# Altium schematic sheet Microcontroller.SchDoc
size A4; SheetNumber: 2; SheetTotal: 5
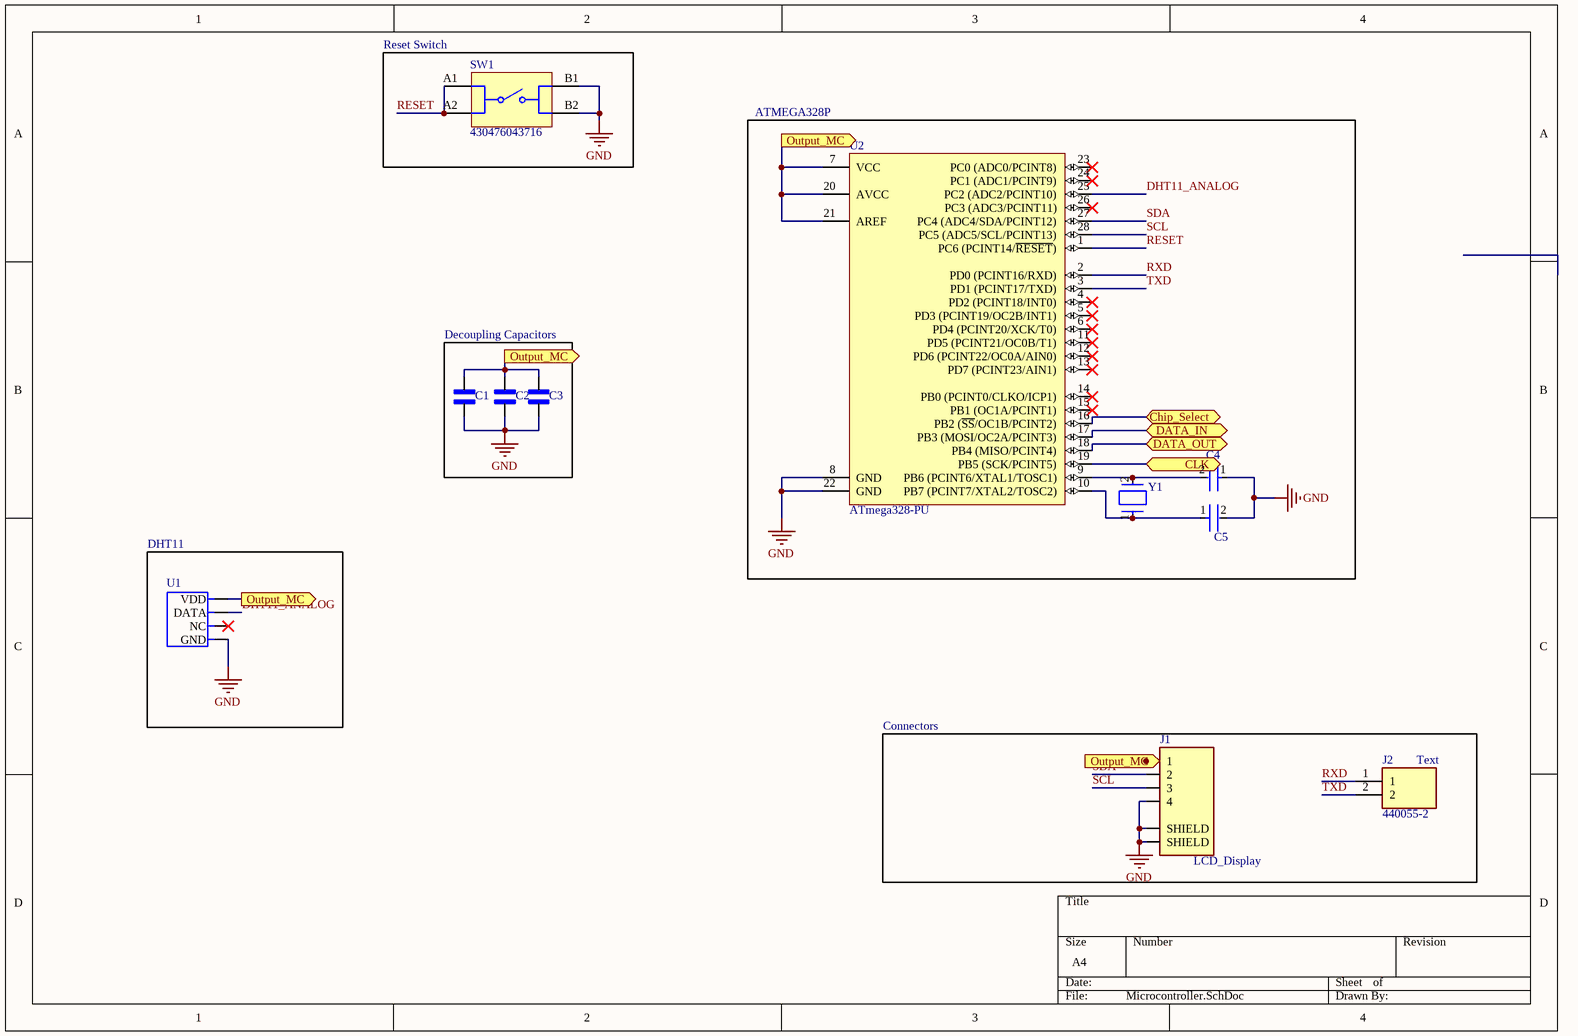
[diagram p0: Microcontroller.SchDoc]

## Parts
C1  GRM033C71C104ME14D  [CAPC0603X33N]  (value not drawn)
C2  GRM033C71C104ME14D  [CAPC0603X33N]  (value not drawn)
C3  GRM033C71C104ME14D  [CAPC0603X33N]  (value not drawn)
C4  C0603X104K5RACTU  [FP-C0603-CJ-MFG]  (value not drawn)
C5  C0603X104K5RACTU  [FP-C0603-CJ-MFG]  (value not drawn)
J1  SM04B-SRSS-TB(LF)(SN)  [JST_SM04B-SRSS-TB(LF)(SN)]  (value not drawn)
J2  440055-2  [TE_440055-2]
SW1  430476043716  [4304x60437x6]
U1  TEM-HUM-DHT11(4P-15.5X12.0MM)  [SNR4-2.54-15.5X12.0X5.5MM]  (value not drawn)
U2  ATmega328-PU  [28P3]
Y1  ABM3-8.000MHZ-D2Y-T  [FP-ABM3-MFG]  (value not drawn)

## Blocks framed on the sheet
Reset Switch: SW1
ATMEGA328P: C4 C5 U2 Y1
Decoupling Capacitors: C1-C3
DHT11: U1

## Ports
Chip_Select (bidir), CLK (bidir), DATA_IN (bidir), DATA_OUT (bidir), Output_MC (out)

## Nets
GND: C1.1 C2.1 C3.1 C4.1 C5.2 J1.4 J1.S1(SHIELD) J1.S2(SHIELD) SW1.B1 SW1.B2 U1.4(GND) U2.8(GND) U2.22(GND)
Chip_Select: U2.16(PB2_(~{SS}/OC1B/PCINT2)) ; port Chip_Select
CLK: U2.19(PB5_(SCK/PCINT5)) ; port CLK
DATA_IN: U2.17(PB3_(MOSI/OC2A/PCINT3)) ; port DATA_IN
DATA_OUT: U2.18(PB4_(MISO/PCINT4)) ; port DATA_OUT
DHT11_ANALOG: U1.2(DATA) U2.25(PC2_(ADC2/PCINT10))
Output_MC: C1.2 C2.2 C3.2 J1.1 U1.1(VDD) U2.7(VCC) U2.20(AVCC) U2.21(AREF) ; port Output_MC
RESET: SW1.A1 SW1.A2 U2.1(PC6_(PCINT14/~{RESET}))
RXD: J2.1 U2.2(PD0_(PCINT16/RXD))
SCL: J1.3 U2.28(PC5_(ADC5/SCL/PCINT13))
SDA: J1.2 U2.27(PC4_(ADC4/SDA/PCINT12))
TXD: J2.2 U2.3(PD1_(PCINT17/TXD))
NetC4_2: C4.2 U2.9(PB6_(PCINT6/XTAL1/TOSC1)) Y1.2
NetC5_1: C5.1 U2.10(PB7_(PCINT7/XTAL2/TOSC2)) Y1.1

Not connected (* = marked no-connect by the designer): U1 3(NC)*; U2 4(PD2_(PCINT18/INT0))* 5(PD3_(PCINT19/OC2B/INT1))* 6(PD4_(PCINT20/XCK/T0))* 11(PD5_(PCINT21/OC0B/T1))* 12(PD6_(PCINT22/OC0A/AIN0))* 13(PD7_(PCINT23/AIN1))* 14(PB0_(PCINT0/CLKO/ICP1))* 15(PB1_(OC1A/PCINT1))* 23(PC0_(ADC0/PCINT8))* 24(PC1_(ADC1/PCINT9))* 26(PC3_(ADC3/PCINT11))*

## Notes on the sheet
- Connectors
- (near J2) Text
- (near J1) LCD_Display

## Library data of the parts
C1-C3 = GRM033C71C104ME14D: Cap Ceramic 0.1uF 16V X7S 20% Pad SMD 0201 125C T/R; MF: {'manufacturer': u'Murata'}; Package: None; Price: None; Value: *; MP: GRM033C71C104ME14D; Availability: Unavailable
C4 C5 = CMP-2006-03300-2: CAP CER 0.1UF 50V X7R 0603; Manufacturer: Kemet; Capacitance: 100nF; Material: Ceramic; Tolerance: 10%; Value: 100nF; Temperature Coefficient: 15%; Temperature Range High: +125°C; Temperature Range Low: -55°C; Manufacturer Part Number: C0603X104K5RACTU; Voltage: 50V; ComponentLink2Description: Datasheet; RoHS: TRUE; ComponentLink2URL: https://content.kemet.com/datasheets/KEM_C1013_X7R_FT-CAP_SMD.pdf; Device Class L3: Ceramic Capacitors; Device Class L2: Capacitors; Package: C0603-CJ; Height: 0.95mm; Device Class L1: Passive Components; Temperature Characteristic: X7R; Lead Free: Yes; Digikey Description: CAP CER 0.1UF 50V X7R 0603; Automotive: No; Mouser Description: Capacitor; Ceramic; Cap 0.1uF; Tol+10%; SMT; Flexible Termination; Vol-Rtg 50V; TR; Temperature: -55°C to +125°C; Octopart: https://octopart.com/c0603x104k5ractu-kemet-9145062; Category: Cap; Voltage Rating: 50V; Ipc Land Pattern Name: CAPC16080X80
J1 = SM04B-SRSS-TB(LF)(SN): SH Series 1.0 mm Pitch 2 Position Single Row Side Entry Shrouded Header; MF: {'manufacturer': u'JST Sales'}; Package: None; Price: None; Value: *; MP: SM04B-SRSS-TB(LF)(SN); Availability: Unavailable
J2 = 440055-2: MF: {'manufacturer': u'TE Connectivity'}; Package: None; Price: None; Value: *; MP: 440055-2; Availability: Unavailable
SW1 = CMP-1456-00007-2: NexarPartId: 31136478; Insulation Resistance: 100MΩ; Actuator Length: 800µm; Illumination Type: Illuminated, Non-Illuminated; Switch Function: Off-Mom; Mechanical Life: 500kcycles; Voltage Rating: 12V; Switch Travel: 300µm; Actuator Material: Liquid Crystal Polymer, Polymer; Current Rating: 50mA; Throw Configuration: SPST; Contact Plating: Silver; RoHS: Compliant; Contact Material: Silver, Stainless Steel; Height: 4.3mm; Mount: Through Hole; Min Operating Temperature: -40°C; Termination: PC Pin; Max Operating Temperature: 85°C; REACH SVHC: No SVHC; Packaging: Bulk; Contact Current Rating: 50mA
U1 = TEM-HUM-DHT11(4P-15.5X12.0MM): 314010000; MF: {'manufacturer': u'UNIVERSAL-SOLDER Electronics Ltd'}; MP: DHT11; Package: None; Price: None; Value: *; Availability: Unavailable
U2 = CMP-0095-00015-2: 8-bit AVR Microcontroller, 32KB Flash, 1KB EEPROM, 2KB SRAM, 28-pin PDIP, Industrial Grade (-40°C to 85°C); ComponentLink3Description: ATmega48A/48PA/88A/88PA/168A/168PA/328/328P Summary; RevisionNote: DatasheetVersion updated. URLs added.; DatasheetVersion: revD, May-2011; ComponentLink1URL: http://www.atmel.com/; PackageVersion: revB, Sep-2001; PackageDescription: 28-lead (0.300"/7.62mm Wide) Plastic Dual Inline Package (PDIP); PackageReference: 28P3; ComponentLink1Description: Manufacturer URL; ComponentLink2Description: ATmega48A/48PA/88A/88PA/168A/168PA/328/328P Datasheet; ComponentLink3URL: http://www.atmel.com/dyn/resources/prod_documents/8271S.pdf; ComponentLink2URL: http://www.atmel.com/dyn/resources/prod_documents/8271.pdf
Y1 = CMP-2000-05033-2: Crystal 8MHz ±20ppm 18pF SMD-2 5mm x 3.2mm; Series Resistance: 500R; Frequency Stability: 30ppm; ESR (Equivalent Series Resistance): 140R; Load Capacitance: 18pF; Height: 0.051inch; Tolerance: 20ppm; Depth: 3.2mm; Max Operating Temperature: 85°C; Frequency: 8MHz; Termination: SMD/SMT; Lead Free: Lead Free; Number of Pins: 2; Width: 3.2mm; RoHS Compliant: Yes; Resistor Type: Ceramic; Length: 5mm; Mount: Surface Mount; Case/Package: CSMD; Package Quantity: 1000; Radiation Hardening: No; Min Operating Temperature: -40°C; Packaging: Tape and Reel; Frequency Tolerance: 20ppm